# Altium schematic sheet Power_Supply.SchDoc: Power Supply
size A4; Author: Pedro Trenado & Ignacio Cabrera; DrawnBy: Pedro & Ignacio; SheetNumber: 5; Company: ETSI Telecomunicaciones; Address_City: Madrid; Address_Country: Spain; Address_Phone: 910 67 19 00; Address_State_ZIP: 28040; Address_Street: Av. Complutense, 30; TotalSheet: 5; VersionRevision: V 2.0; Address_Website: https://www.etsist.upm.es; #NAME@: pedro.trenado@alumnos.upm.es; License: Student
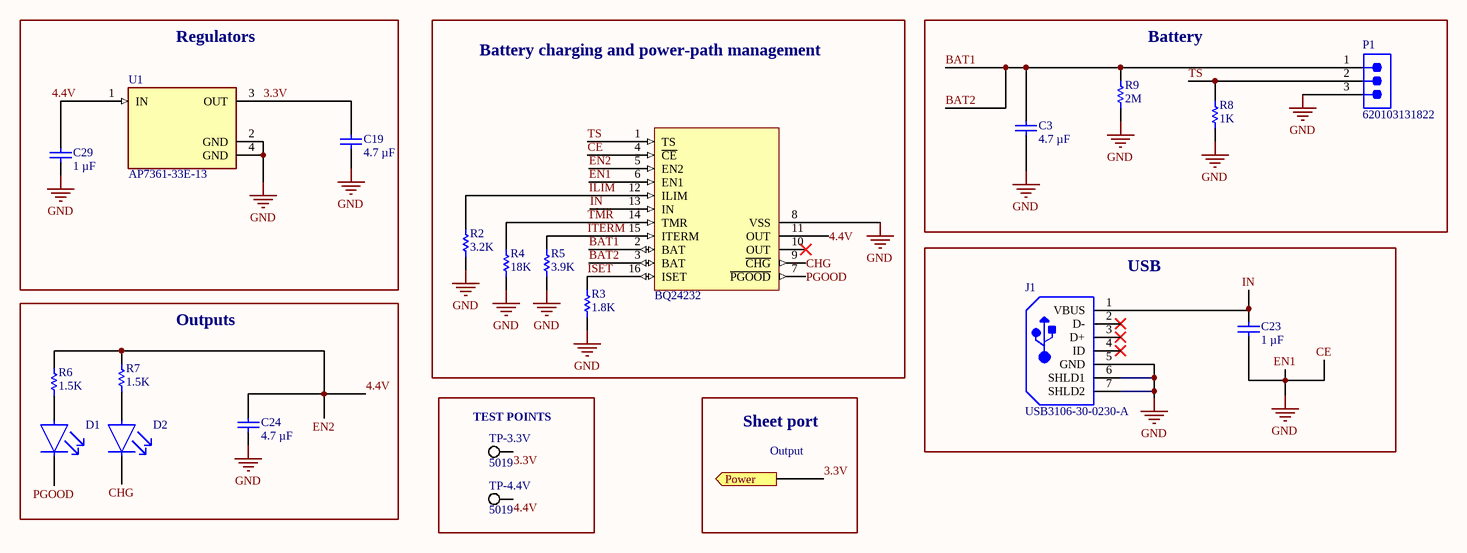
[diagram p0: Power_Supply.SchDoc]

## Parts
BQ24232  BQ24232  [VQFN]
C3  4.7 µF  [CAPC1005X70X10ML20T00]
C19  4.7 µF  [CAPC1005X70X10ML20T00]
C23  1 µF  [CAPC2013X135X45LL10T25]
C24  4.7 µF  [CAPC1005X70X10ML20T00]
C29  1 µF  [CAPC2013X135X45LL10T25]
D1  (no value)  [FP-LTST-C190GKT-MFG]
D2  (no value)  [FP-LTST-C190GKT-MFG]
J1  USB3106-30-0230-A  [GCT-USB3106-30-0230-A_V]
P1  620103131822  [620103131822]
R2  3.2K  [RESC3216X70X50NL05T20]
R3  1.8K  [RESC3216X70X50NL05T20]
R4  18K  [RESC3216X70X50NL05T20]
R5  3.9K  [RESC3216X70X50NL05T20]
R6  1.5K  [RESC3216X70X50NL05T20]
R7  1.5K  [RESC3216X70X50NL05T20]
R8  1K  [RESC3216X70X50NL05T20]
R9  2M  [RESC3216X70X50NL05T20]
TP-3.3V  5019  [KSTN-5019_V]
TP-4.4V  5019  [KSTN-5019_V]
U1  AP7361-33E-13  [FP-SOT223-IPC_C]

## Blocks framed on the sheet
Regulators: C19 C29 U1
Battery charging and power-path management: BQ24232 R2-R5
Battery: C3 P1 R8 R9
USB: C23 J1
Outputs: C24 D1 D2 R6 R7
TEST POINTS: TP-3.3V TP-4.4V

## Ports
Power (out)

## Nets
CE: BQ24232.4(~{CE}) BQ24232.6(EN1) BQ24232.8(VSS) C3.1 C19.1 C23.1 C24.1 C29.1 J1.5(GND) J1.6(SHLD1) J1.7(SHLD2) P1.3 R2.1 R3.1 R4.2 R5.2 R8.1 R9.1 U1.2(GND) U1.4(GND)  [also labelled EN1, GND]
3.3V: C19.2 TP-3.3V.1 U1.3(OUT) ; port Power
4.4V: BQ24232.5(EN2) BQ24232.11(OUT) C24.2 C29.2 R6.2 R7.2 TP-4.4V.1 U1.1(IN)  [also labelled EN2]
BAT1: BQ24232.2(BAT) BQ24232.3(BAT) C3.2 P1.1 R9.2  [also labelled BAT2]
CHG: BQ24232.9(~{CHG}) D2.1(C)
ILIM: BQ24232.12(ILIM) R2.2
IN: BQ24232.13(IN) C23.2 J1.1(VBUS)
ISET: BQ24232.16(ISET) R3.2
ITERM: BQ24232.15(ITERM) R5.1
PGOOD: BQ24232.7(~{PGOOD}) D1.1(C)
TMR: BQ24232.14(TMR) R4.1
TS: BQ24232.1(TS) P1.2 R8.2

Not connected (* = marked no-connect by the designer): BQ24232 10(OUT)*; D1 2(A); D2 2(A); J1 2(D-)* 3(D+)* 4(ID)*; R6 1; R7 1

## Notes on the sheet
- (near BQ24232) ISET defines the charging speed, we defined the smaller resistance that allows to have a fast charge.
  TMR controls the precharge and fast-charge safety timers.
- We have used this linear regulators to divide the voltage from the output voltage of the BQ24232 to 3.3V, because our components require less than 4.4V.
- Sheet port
- Output
- Title:
- Drawn By:
- Page Contents:
- Checked By:
- Size:
- Date:
- File:
- License:
- Email:
- A4
- Number:
- Time:
- Revision:
- Sheet
- Website:
- of

## Library data of the parts
BQ24232 = BQ24232: Company: ETSI Telecomunicaciones
C3 C19 C24 = CMP-2008-00074-1: Manufacturer: AVX Interconnect / Elco; Part Number: TACK475M003QTA
C23 C29 = CMP-1036-04761-2: Manufacturer: Murata; Part Number: GRM21BR71H105KA12L
D1 D2 = CMP-22017-000005-2: LED GREEN CLEAR CHIP SMD; Dominant Wavelength: 569nm; Reverse Voltage: 5V; Lens Color: Colorless; Viewing Angle: 130°; Voltage: 2V; Forward Current: 30mA; Power Dissipation: 100mW; Luminous Intensity: 6mcd; Number of LEDs: 1; Forward Voltage: 2.1V; Wavelength: 565nm; Test Current: 10mA; Min Operating Temperature: -55°C; Lens Style: Clear; Mount: Surface Mount; Width: 0.8mm; Packaging: Tape and Reel; Lens Transparency: Clear; Case Code (Metric): 1608; Depth: 0.8mm; Case Code (Imperial): 0603; Case/Package: 0603; Number of Pins: 2; Max Operating Temperature: 85°C; Lead Free: Lead Free; Number of Elements: 1; Length: 1.6mm; Height: 0.8mm; Package Quantity: 1; Power Rating: 100mW; Radiation Hardening: No; Illumination Color: Green; Color: Green
J1 = CMP-2000-07367-1: uUSB Receptacle, Type A/B, Vertical, Through Hole with 2.30 mm (Standard) Shell Stakes, 5-Pin THD, RoHS, Tape and Reel; Manufacturer: Global Connector Technology; USB Connector Type: MicroUSBTypeAB; SVHC: NoSVHC(17-Dec-2015); USB Standard: USB2.0; Connector Mounting: ThroughHoleMount; No. of Positions: 5Ways; Datasheet Version: Rev. B, 05/2015; Orientation: Vertical; Manufacturer URL: http://gct.co/; Package Reference: USB3106-30-0230-A; Contact Plating: GoldPlatedContacts; Package Description: 5-Pin Through Hole Device, Body 7.96 x 2.9 mm, Pitch 0.65 mm; Gender: Receptacle; Mounting Technology: ThroughHole; Contact Material: CopperAlloy; Product Range: -; Datasheet URL: http://gct.co/PDFjs/web/viewer.html?file=/usb-connectors/pdf/USB3106.pdf
P1 = CMP-1502-00670-2: NexarPartId: 18818239; Insulation Resistance: 1GΩ; Pitch: 2mm; Number of Positions: 3; Voltage Rating: 125V; Insulation: Insulated; Gender: Male; Connector Type: Male Pin; Current Rating: 2A; Operating Supply Voltage: 100V; Contact Resistance: 20mΩ; Height: 5.6mm; Contact Gender: Male; Contact Mating Length: 3.683mm; Lead Free: Lead Free; Termination: SMD/SMT; REACH SVHC: Unknown; Width: 10mm; Lead Pitch: 2mm; Number of Contacts: 3; Color: Beige, White; Max Operating Temperature: 85°C; Housing Material: Nylon; Packaging: Tape and Reel; Number of Pins: 3; Length: 10mm; Contact Material: Copper; Contact Plating: Tin; Number of Rows: 1; Flammability Rating: UL94 V-0; RoHS: Compliant; Min Operating Temperature: -40°C; Mount: Surface Mount
R2-R9 = CMP-2003-00541-1: Manufacturer: Panasonic; Part Number: ERJ-8GEY0R00V
TP-3.3V TP-4.4V = CMP-1672-00008-1: Test Point, 1 Position SMD, RoHS, Tape and Reel; ComponentLink1Description: Manufacturer URL; Package Quantity: 1000; DatasheetVersion: 03/2014; Packaging: Tape and Reel; ComponentLink2URL: http://www.keyelco.com/product-pdf.cfm?p=1357; ComponentLink1URL: http://www.keyelco.com/; Mount: Surface Mount; Contact Plating: Silver; PackageDescription: 1-Pin Surface Mount Device, Body 3.81 x 2.03 mm; Pins: 1; RoHSCompliant: True; Mounting Technology: Surface Mount; ComponentLink2Description: Datasheet; PackageReference: 5019
U1 = CMP-12756-000024-1: IC REG LINEAR 3.3V 1A SOT223; Min Current Limit: 1.1A; Power Supply Rejection Ratio (PSRR): 65dB; Quiescent Current: 70uA; Min Input Voltage: 2.2V; Max Input Voltage: 6V; Number of Regulators: 1; Output Type: Fixed; Accuracy: 1%; Reference Voltage: 800mV; Power Dissipation: 1.1kW; Max Power Dissipation: 1.1W; Dropout Voltage: 500mV; Polarity: Positive; Weight: 0.000282oz; Lead Free: Lead Free; Max Output Current: 1A; Contact Plating: Tin; Output Current: 1A; REACH SVHC: No SVHC; Min Operating Temperature: -40°C; Packaging: Tape and Reel; Output Voltage: 3.3V; Mount: Surface Mount; Case/Package: SOT-223; Radiation Hardening: No; Number of Pins: 4; Max Operating Temperature: 85°C; Package Quantity: 1; Number of Outputs: 1